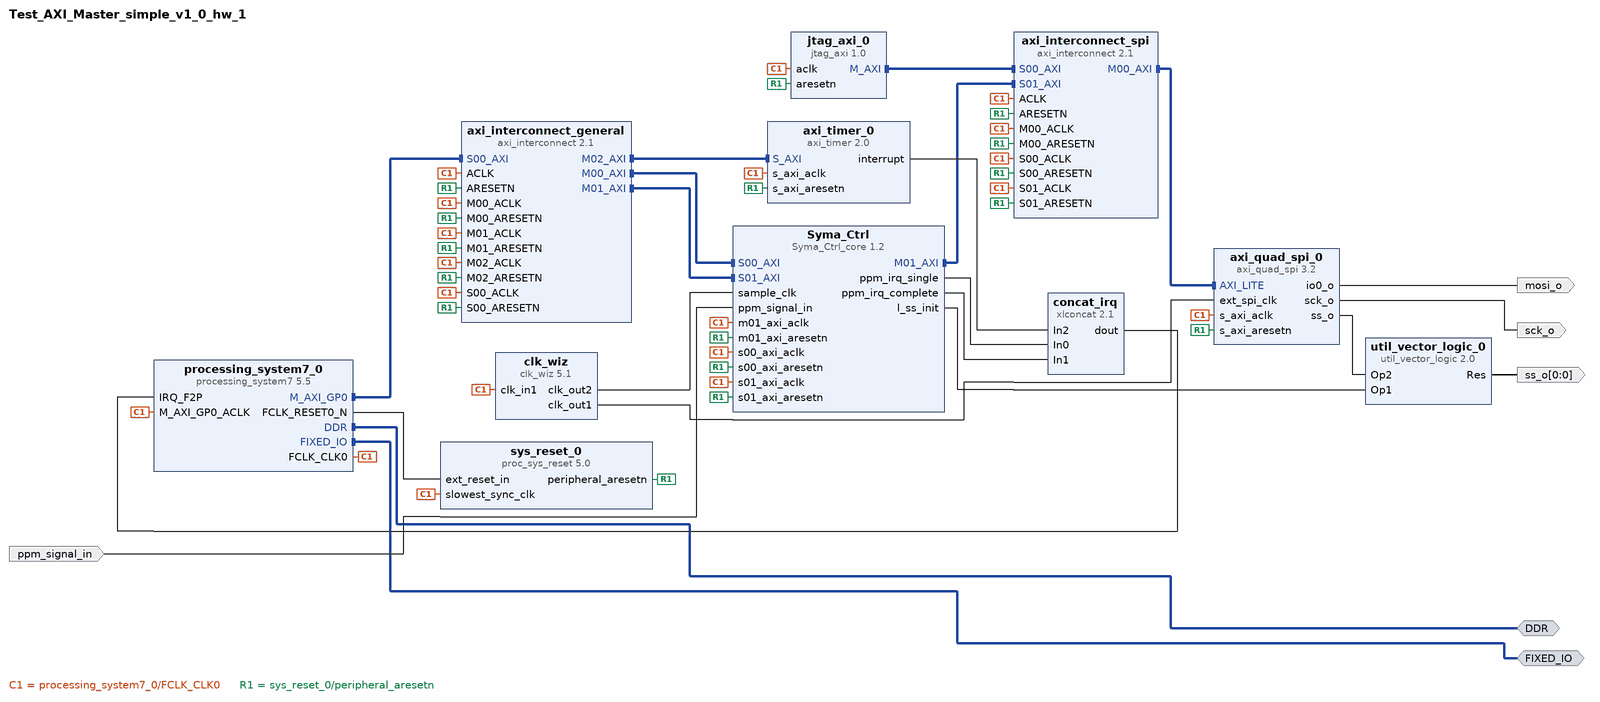
[diagram p0: block diagram of the top level]
# Vivado block design Test_AXI_Master_simple_v1_0_hw_1, Vivado 2014.4
create_bd_design Test_AXI_Master_simple_v1_0_hw_1

create_bd_intf_port -mode Master -vlnv xilinx.com:interface:ddrx_rtl:1.0 DDR
create_bd_intf_port -mode Master -vlnv xilinx.com:display_processing_system7:fixedio_rtl:1.0 FIXED_IO
create_bd_port -dir I ppm_signal_in
create_bd_port -dir O mosi_o
create_bd_port -dir O sck_o
create_bd_port -dir O -from 0 -to 0 ss_o

create_bd_cell -type ip -vlnv xilinx.com:ip:processing_system7:5.5 processing_system7_0
set_property -dict [list \
  CONFIG.PCW_FCLK_CLK0_BUF true \
  CONFIG.PCW_APU_PERIPHERAL_FREQMHZ 666.666666 \
  CONFIG.PCW_QSPI_PERIPHERAL_FREQMHZ 200.000000 \
  CONFIG.PCW_SDIO_PERIPHERAL_FREQMHZ 50 \
  CONFIG.PCW_UART_PERIPHERAL_FREQMHZ 50 \
  CONFIG.PCW_FPGA0_PERIPHERAL_FREQMHZ 100 \
  CONFIG.PCW_FPGA1_PERIPHERAL_FREQMHZ 100 \
  CONFIG.PCW_FPGA2_PERIPHERAL_FREQMHZ 33.333333 \
  CONFIG.PCW_USE_FABRIC_INTERRUPT 1 \
  CONFIG.PCW_IRQ_F2P_INTR 1 \
  CONFIG.PCW_PRESET_BANK1_VOLTAGE {LVCMOS 1.8V} \
  CONFIG.PCW_UIPARAM_DDR_PARTNO {MT41K256M16 RE-125} \
  CONFIG.PCW_QSPI_PERIPHERAL_ENABLE 1 \
  CONFIG.PCW_QSPI_GRP_SINGLE_SS_ENABLE 1 \
  CONFIG.PCW_QSPI_GRP_SINGLE_SS_IO {MIO 1 .. 6} \
  CONFIG.PCW_QSPI_GRP_FBCLK_ENABLE 1 \
  CONFIG.PCW_QSPI_GRP_FBCLK_IO {MIO 8} \
  CONFIG.PCW_ENET0_PERIPHERAL_ENABLE 1 \
  CONFIG.PCW_ENET0_ENET0_IO {MIO 16 .. 27} \
  CONFIG.PCW_ENET0_GRP_MDIO_ENABLE 1 \
  CONFIG.PCW_ENET0_GRP_MDIO_IO {MIO 52 .. 53} \
  CONFIG.PCW_SD0_PERIPHERAL_ENABLE 1 \
  CONFIG.PCW_SD0_SD0_IO {MIO 40 .. 45} \
  CONFIG.PCW_SD0_GRP_CD_ENABLE 1 \
  CONFIG.PCW_SD0_GRP_CD_IO {MIO 46} \
  CONFIG.PCW_SD0_GRP_WP_ENABLE 1 \
  CONFIG.PCW_SD0_GRP_WP_IO {MIO 50} \
  CONFIG.PCW_UART1_PERIPHERAL_ENABLE 1 \
  CONFIG.PCW_UART1_UART1_IO {MIO 48 .. 49} \
  CONFIG.PCW_TTC0_PERIPHERAL_ENABLE 1 \
  CONFIG.PCW_TTC0_TTC0_IO EMIO \
  CONFIG.PCW_USB0_PERIPHERAL_ENABLE 0 \
  CONFIG.PCW_GPIO_PERIPHERAL_ENABLE 1 \
  CONFIG.PCW_GPIO_MIO_GPIO_ENABLE 1 \
  CONFIG.preset {Default*} \
] [get_bd_cells processing_system7_0]
# 157 more settings of processing_system7_0 are not shown: defaults, MIO pin electricals, DDR timing, and values the tool derives
create_bd_cell -type ip -vlnv xilinx.com:ip:clk_wiz:5.1 clk_wiz
set_property -dict [list \
  CONFIG.CLKOUT2_USED true \
  CONFIG.CLKOUT1_REQUESTED_OUT_FREQ 7.3728 \
  CONFIG.CLKOUT2_REQUESTED_OUT_FREQ 24 \
  CONFIG.USE_LOCKED false \
  CONFIG.USE_RESET false \
] [get_bd_cells clk_wiz]
create_bd_cell -type ip -vlnv xilinx.com:ip:proc_sys_reset:5.0 sys_reset_0
create_bd_cell -type ip -vlnv xilinx.com:ip:axi_quad_spi:3.2 axi_quad_spi_0
set_property -dict {CONFIG.C_USE_STARTUP 0 CONFIG.Multiples16 2} [get_bd_cells axi_quad_spi_0]
create_bd_cell -type ip -vlnv rcs.ei.tum.de:user:Syma_Ctrl_core:1.2 Syma_Ctrl
set_property -dict [list \
  CONFIG.C_M01_AXI_TARGET_SLAVE_BASE_ADDR 0x44A00000 \
  CONFIG.C_M01_AXI_TRANSACTIONS_NUM 1 \
  CONFIG.DEBUG 0 \
] [get_bd_cells Syma_Ctrl]
create_bd_cell -type ip -vlnv xilinx.com:ip:axi_timer:2.0 axi_timer_0
create_bd_cell -type ip -vlnv xilinx.com:ip:jtag_axi:1.0 jtag_axi_0
set_property -dict {CONFIG.PROTOCOL 0} [get_bd_cells jtag_axi_0]
create_bd_cell -type ip -vlnv xilinx.com:ip:axi_interconnect:2.1 axi_interconnect_spi
set_property -dict {CONFIG.NUM_SI 2 CONFIG.NUM_MI 1} [get_bd_cells axi_interconnect_spi]
create_bd_cell -type ip -vlnv xilinx.com:ip:axi_interconnect:2.1 axi_interconnect_general
set_property -dict {CONFIG.NUM_MI 3} [get_bd_cells axi_interconnect_general]
create_bd_cell -type ip -vlnv xilinx.com:ip:xlconcat:2.1 concat_irq
set_property -dict {CONFIG.NUM_PORTS 3} [get_bd_cells concat_irq]
create_bd_cell -type ip -vlnv xilinx.com:ip:util_vector_logic:2.0 util_vector_logic_0
set_property -dict {CONFIG.C_SIZE 1 CONFIG.C_OPERATION xor} [get_bd_cells util_vector_logic_0]

# ---- connections ----

connect_bd_intf_net [get_bd_intf_pins axi_interconnect_spi/M00_AXI] [get_bd_intf_pins axi_quad_spi_0/AXI_LITE]
connect_bd_intf_net [get_bd_intf_pins axi_interconnect_spi/S00_AXI] [get_bd_intf_pins jtag_axi_0/M_AXI]
connect_bd_intf_net [get_bd_intf_pins axi_interconnect_spi/S01_AXI] [get_bd_intf_pins Syma_Ctrl/M01_AXI]
connect_bd_intf_net [get_bd_intf_pins axi_interconnect_general/M00_AXI] [get_bd_intf_pins Syma_Ctrl/S00_AXI]
connect_bd_intf_net [get_bd_intf_pins axi_interconnect_general/M01_AXI] [get_bd_intf_pins Syma_Ctrl/S01_AXI]
connect_bd_intf_net [get_bd_intf_pins processing_system7_0/M_AXI_GP0] [get_bd_intf_pins axi_interconnect_general/S00_AXI]
connect_bd_intf_net [get_bd_intf_pins axi_interconnect_general/M02_AXI] [get_bd_intf_pins axi_timer_0/S_AXI]
connect_bd_intf_net [get_bd_intf_ports DDR] [get_bd_intf_pins processing_system7_0/DDR]
connect_bd_intf_net [get_bd_intf_ports FIXED_IO] [get_bd_intf_pins processing_system7_0/FIXED_IO]
connect_bd_net [get_bd_pins processing_system7_0/FCLK_CLK0] \
  [get_bd_pins clk_wiz/clk_in1] [get_bd_pins sys_reset_0/slowest_sync_clk] [get_bd_pins jtag_axi_0/aclk] \
  [get_bd_pins axi_interconnect_spi/ACLK] [get_bd_pins axi_interconnect_spi/S00_ACLK] \
  [get_bd_pins axi_interconnect_spi/M00_ACLK] [get_bd_pins axi_interconnect_spi/S01_ACLK] \
  [get_bd_pins axi_interconnect_general/ACLK] [get_bd_pins axi_interconnect_general/S00_ACLK] \
  [get_bd_pins axi_interconnect_general/M00_ACLK] [get_bd_pins axi_interconnect_general/M01_ACLK] \
  [get_bd_pins Syma_Ctrl/s00_axi_aclk] [get_bd_pins Syma_Ctrl/s01_axi_aclk] [get_bd_pins Syma_Ctrl/m01_axi_aclk] \
  [get_bd_pins axi_quad_spi_0/s_axi_aclk] [get_bd_pins axi_interconnect_general/M02_ACLK] \
  [get_bd_pins axi_timer_0/s_axi_aclk] [get_bd_pins processing_system7_0/M_AXI_GP0_ACLK]
connect_bd_net [get_bd_pins processing_system7_0/FCLK_RESET0_N] [get_bd_pins sys_reset_0/ext_reset_in]
connect_bd_net [get_bd_pins clk_wiz/clk_out1] [get_bd_pins axi_quad_spi_0/ext_spi_clk]
connect_bd_net [get_bd_pins clk_wiz/clk_out2] [get_bd_pins Syma_Ctrl/sample_clk]
connect_bd_net [get_bd_pins sys_reset_0/peripheral_aresetn] \
  [get_bd_pins jtag_axi_0/aresetn] [get_bd_pins axi_interconnect_spi/S01_ARESETN] \
  [get_bd_pins axi_interconnect_spi/M00_ARESETN] [get_bd_pins axi_interconnect_spi/S00_ARESETN] \
  [get_bd_pins axi_interconnect_spi/ARESETN] [get_bd_pins axi_interconnect_general/ARESETN] \
  [get_bd_pins axi_interconnect_general/S00_ARESETN] [get_bd_pins axi_interconnect_general/M00_ARESETN] \
  [get_bd_pins axi_interconnect_general/M01_ARESETN] [get_bd_pins Syma_Ctrl/s00_axi_aresetn] \
  [get_bd_pins Syma_Ctrl/s01_axi_aresetn] [get_bd_pins Syma_Ctrl/m01_axi_aresetn] [get_bd_pins axi_quad_spi_0/s_axi_aresetn] \
  [get_bd_pins axi_interconnect_general/M02_ARESETN] [get_bd_pins axi_timer_0/s_axi_aresetn]
connect_bd_net [get_bd_pins Syma_Ctrl/ppm_irq_single] [get_bd_pins concat_irq/In0]
connect_bd_net [get_bd_pins Syma_Ctrl/ppm_irq_complete] [get_bd_pins concat_irq/In1]
connect_bd_net [get_bd_pins axi_timer_0/interrupt] [get_bd_pins concat_irq/In2]
connect_bd_net [get_bd_pins concat_irq/dout] [get_bd_pins processing_system7_0/IRQ_F2P]
connect_bd_net [get_bd_ports ppm_signal_in] [get_bd_pins Syma_Ctrl/ppm_signal_in]
connect_bd_net [get_bd_pins Syma_Ctrl/l_ss_init] [get_bd_pins util_vector_logic_0/Op1]
connect_bd_net [get_bd_pins axi_quad_spi_0/ss_o] [get_bd_pins util_vector_logic_0/Op2]
connect_bd_net [get_bd_pins axi_quad_spi_0/io0_o] [get_bd_ports mosi_o]
connect_bd_net [get_bd_pins axi_quad_spi_0/sck_o] [get_bd_ports sck_o]
connect_bd_net [get_bd_pins util_vector_logic_0/Res] [get_bd_ports ss_o]

# ---- address map ----
assign_bd_address -offset 0x44A00000 -range 64K -target_address_space [get_bd_addr_spaces jtag_axi_0/Data] [get_bd_addr_segs axi_quad_spi_0/AXI_LITE/Reg]
assign_bd_address -offset 0x42800000 -range 64K -target_address_space [get_bd_addr_spaces processing_system7_0/Data] [get_bd_addr_segs axi_timer_0/S_AXI/Reg]
assign_bd_address -offset 0x43C00000 -range 64K -target_address_space [get_bd_addr_spaces processing_system7_0/Data] [get_bd_addr_segs Syma_Ctrl/S00_AXI/S00_AXI_reg]
assign_bd_address -offset 0x43C10000 -range 64K -target_address_space [get_bd_addr_spaces processing_system7_0/Data] [get_bd_addr_segs Syma_Ctrl/S01_AXI/S01_AXI_reg]
assign_bd_address -offset 0x44A00000 -range 64K -target_address_space [get_bd_addr_spaces Syma_Ctrl/M01_AXI] [get_bd_addr_segs axi_quad_spi_0/AXI_LITE/Reg]

validate_bd_design
save_bd_design
